# EAGLE design untitled (EAGLE 6.1)
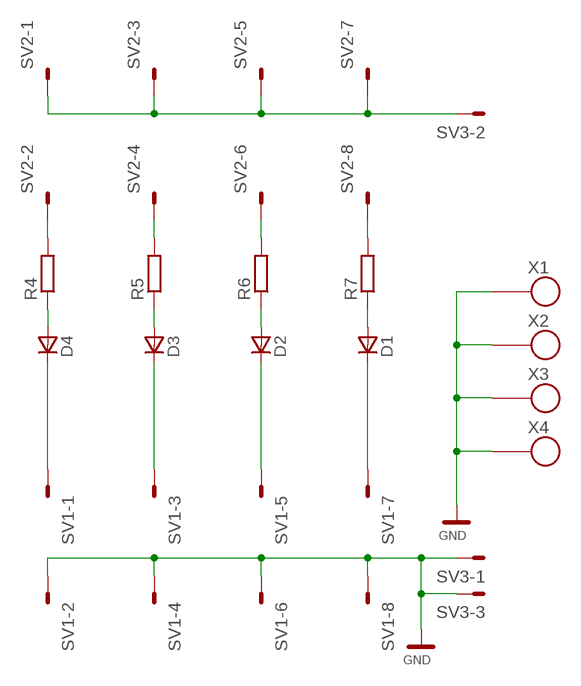
[diagram p0: schematic, sheet 1]

## Parts
D1  LED1206  [1206]
D2  LED1206  [1206]
D3  LED1206  [1206]
D4  LED1206  [1206]
R4  R0805  [0805]
R5  R0805  [0805]
R6  R0805  [0805]
R7  R0805  [0805]
SV1  MA04-3  [MA04-2]
SV2  MA04-3  [MA04-2]
SV3  MA03-1  [MA03-1]
X1  SROUB3M  [SROUB3M]
X2  SROUB3M  [SROUB3M]
X3  SROUB3M  [SROUB3M]
X4  SROUB3M  [SROUB3M]

## Nets
GND: SV1.2 SV1.4 SV1.6 SV1.8 SV3.1 SV3.3 X1.P$1 X2.P$1 X3.P$1 X4.P$1
N$1: D4.K SV1.1
N$2: D4.A R4.1
N$3: D3.K SV1.3
N$4: D2.K SV1.5
N$5: D3.A R5.1
N$7: D2.A R6.1
N$8: D1.A R7.1
N$9: R4.2 SV2.2
N$10: R5.2 SV2.4
N$11: R6.2 SV2.6
N$12: D1.K SV1.7
N$13: SV2.1 SV2.3 SV2.5 SV2.7 SV3.2
N$14: R7.2 SV2.8

## Library data of the parts
D1-D4 = moje_diody:LED1206: Ecom LEDS-HCL-1505
R4-R7 = moje_R:R0805
SV1 SV2 = moje_hrebinky:MA04-3
SV3 = moje_hrebinky:MA03-1: PIN HEADER; OC_FARNELL: unknown; OC_NEWARK: unknown
X1-X4 = moje:SROUB3M

## Board
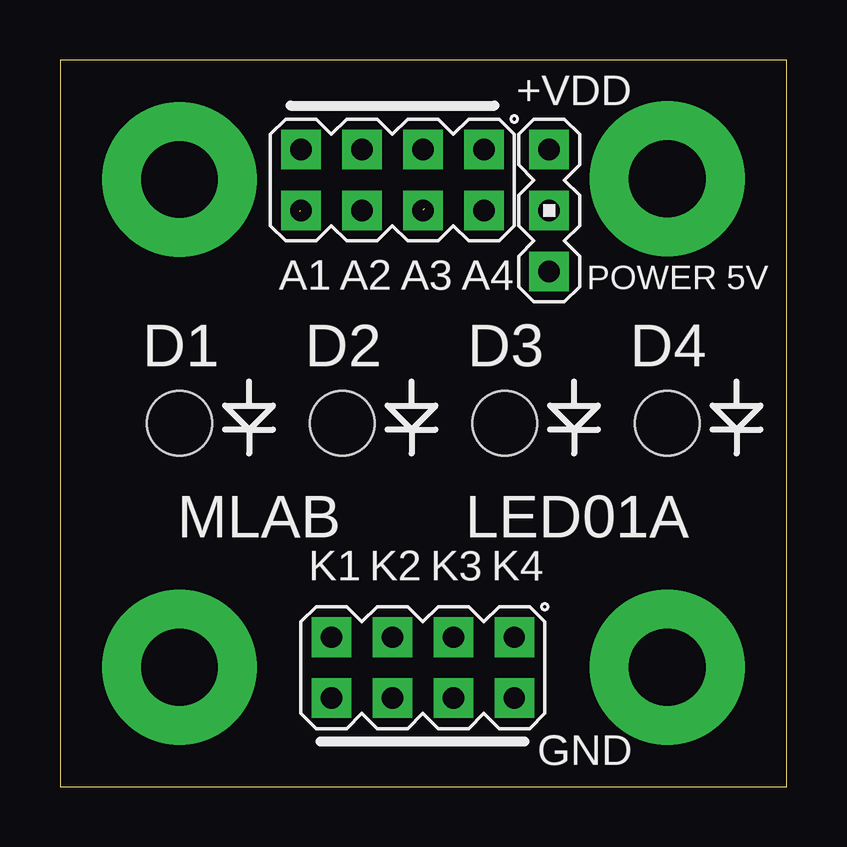
[diagram p1: board, top side]
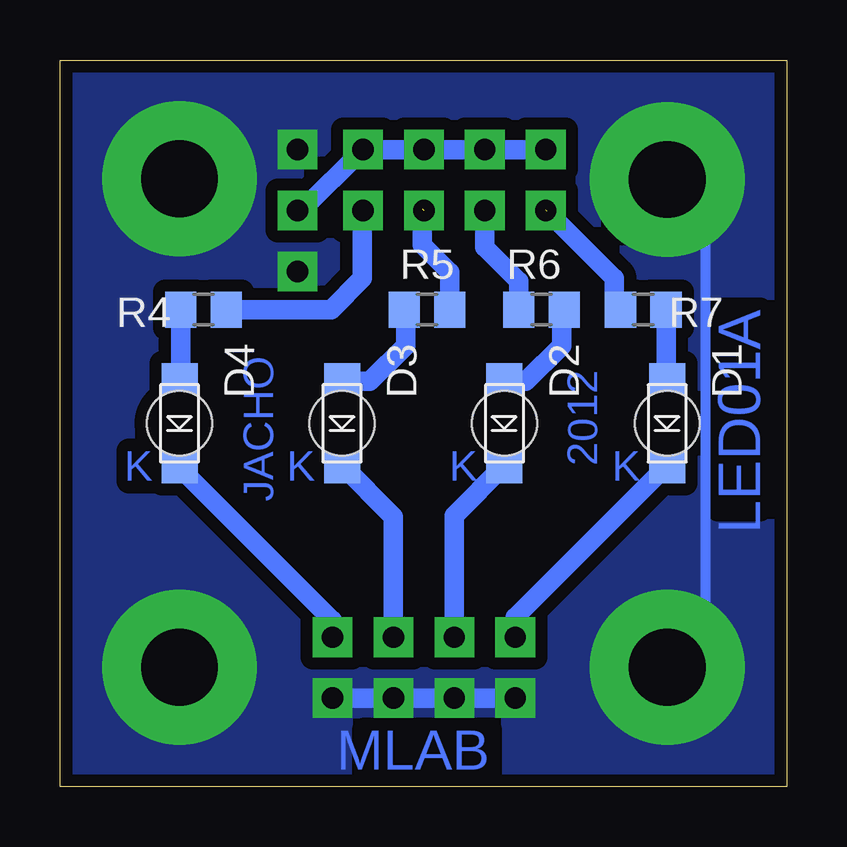
[diagram p2: board, bottom side, seen from below]

Size 30.28 x 30.28 mm. Coordinates in mm from the lower left corner, seen from the top.
Outline: 30.28,30.28 0,30.28 0,0 30.28,0 30.28,30.28
Copper layers (1*16): Top 0.035mm / dielectric 1mm / Bottom 0.035mm
Design rules: minimum track width 12mil, minimum drill 24mil, track to track 20mil, track to pad 20mil, pad to pad 20mil, via to via 20mil, smd to smd 8mil, copper to edge 20mil, drill to drill 70mil, minimum pad ring 10mil, minimum via ring 8mil, stop-mask expansion 5mil, vias tented up to drill 0mil, thermal gap 0mil

### Footprints (pad centres in the part's own frame; a part is rotated, then mirrored left to right if it is on the bottom)
1206 = smd 1.5 x 1.5: A 0,-1.75; K 0,1.75 | hole 2.7: 0,0
0805 = smd 1.3 x 1.5: 1 -0.95,0; 2 0.95,0
MA04-2 = drill 0.889 pad 1.651 square: 1 -3.81,-1.27; 2 -3.81,1.27; 3 -1.27,-1.27; 4 -1.27,1.27; 5 1.27,-1.27; 6 1.27,1.27; 7 3.81,-1.27; 8 3.81,1.27
MA03-1 = drill 0.889 pad 1.651 square: 1 -2.54,0; 2 0,0; 3 2.54,0
SROUB3M = drill 3.2 pad 6.452: P$1 0,0

### Placement (x,y rotation side)
D1  4.98,15.14 180 bottom
D2  11.76,15.14 180 bottom
D3  18.53,15.14 180 bottom
D4  25.3,15.14 180 bottom
R4  24.3,19.88 0 bottom
R5  14.99,19.88 0 bottom
R6  10.22,19.88 180 bottom
R7  5.98,19.88 180 bottom
SV1  15.12,4.96 180 top
SV2  13.85,25.28 180 top
SV3  20.38,24.01 90 top
X1  4.98,4.98 180 top
X2  4.98,25.3 180 top
X3  25.3,25.33 180 top
X4  25.3,4.98 270 top

### Tracks (layer width: path | path; a pad name or v marks a point on that pad's centre or on a via)
GND
  Bottom 0.406: X1.P$1 3.38,4.98 3.38,24.38 4.38,25.38
  Bottom 0.813: SV1.2 SV1.4 SV1.6 SV1.8
  pour Bottom: -0.12,29.88 -0.12,-0.12 30.38,-0.12 30.38,30.38 -0.12,30.38
N$1
  Bottom 0.61: 25.38,13.38 D4.K
  Bottom 0.813: SV1.1 18.93,6.93 25.38,13.38
N$2
  Bottom 0.61: D4.A 25.25,16.89
  Bottom 0.813: 25.25,16.89 R4.1
N$3
  Bottom 0.61: D3.K 18.95,13.39
  Bottom 0.813: SV1.3 16.39,11.25 D3.K
N$4
  Bottom 0.61: D2.K 11.33,13.39
  Bottom 0.813: SV1.5 13.85,11.3 D2.K
N$5
  Bottom 0.61: D3.A 18.48,16.89
  Bottom 0.813: 18.48,16.89 17.37,16.89 15.88,18.38 15.88,19.82 R5.1
N$7
  Bottom 0.61: D2.A 11.81,16.89
  Bottom 0.813: 11.81,16.89 10.87,16.89 9.38,18.38 9.38,19.77 R6.1
N$8
  Bottom 0.61: D1.A 5.03,16.89
  Bottom 0.813: 5.03,16.89 R7.1
N$9
  Bottom 0.61: 17.68,23.99 SV2.2
  Bottom 0.813: R4.2 18.98,19.88 17.68,21.18 17.68,23.99
N$10  (1 unrouted)
  Bottom 0.813: R5.2 14.04,21.44 15.18,22.58 15.18,24.08
N$11
  Bottom 0.813: R6.2 11.17,21.07 12.58,22.48 SV2.6
N$12
  Bottom 0.813: SV1.7 11.31,7.06 D1.K
N$13
  Bottom 0.61: SV3.2 20.2,24.01
  Bottom 0.813: SV2.7 SV2.5 SV2.3 SV2.1 20.2,24.01
N$14  (1 unrouted)
  Bottom 0.61: R7.2 7.18,19.88
  Bottom 0.813: 7.18,19.88 7.18,21.18 9.98,23.98

### Text on the board
Bottom: LED01A | 2012 | JACHO | MLAB
tPlace: +VDD | POWER 5V | A1 | A2 | A3 | A4 | D1 | D2 | D3 | D4 | MLAB | LED01A | K1 | K2 | K3 | K4 | GND